# EasyEDA schematic SCH_CM_Mesa_7i92TH_2024-10-26.json
TITLE: Sheet_1; REV: 1.0; Date: 2022-04-24; Sheet: 1/1; Drawn By: timoa; Company: Your Company
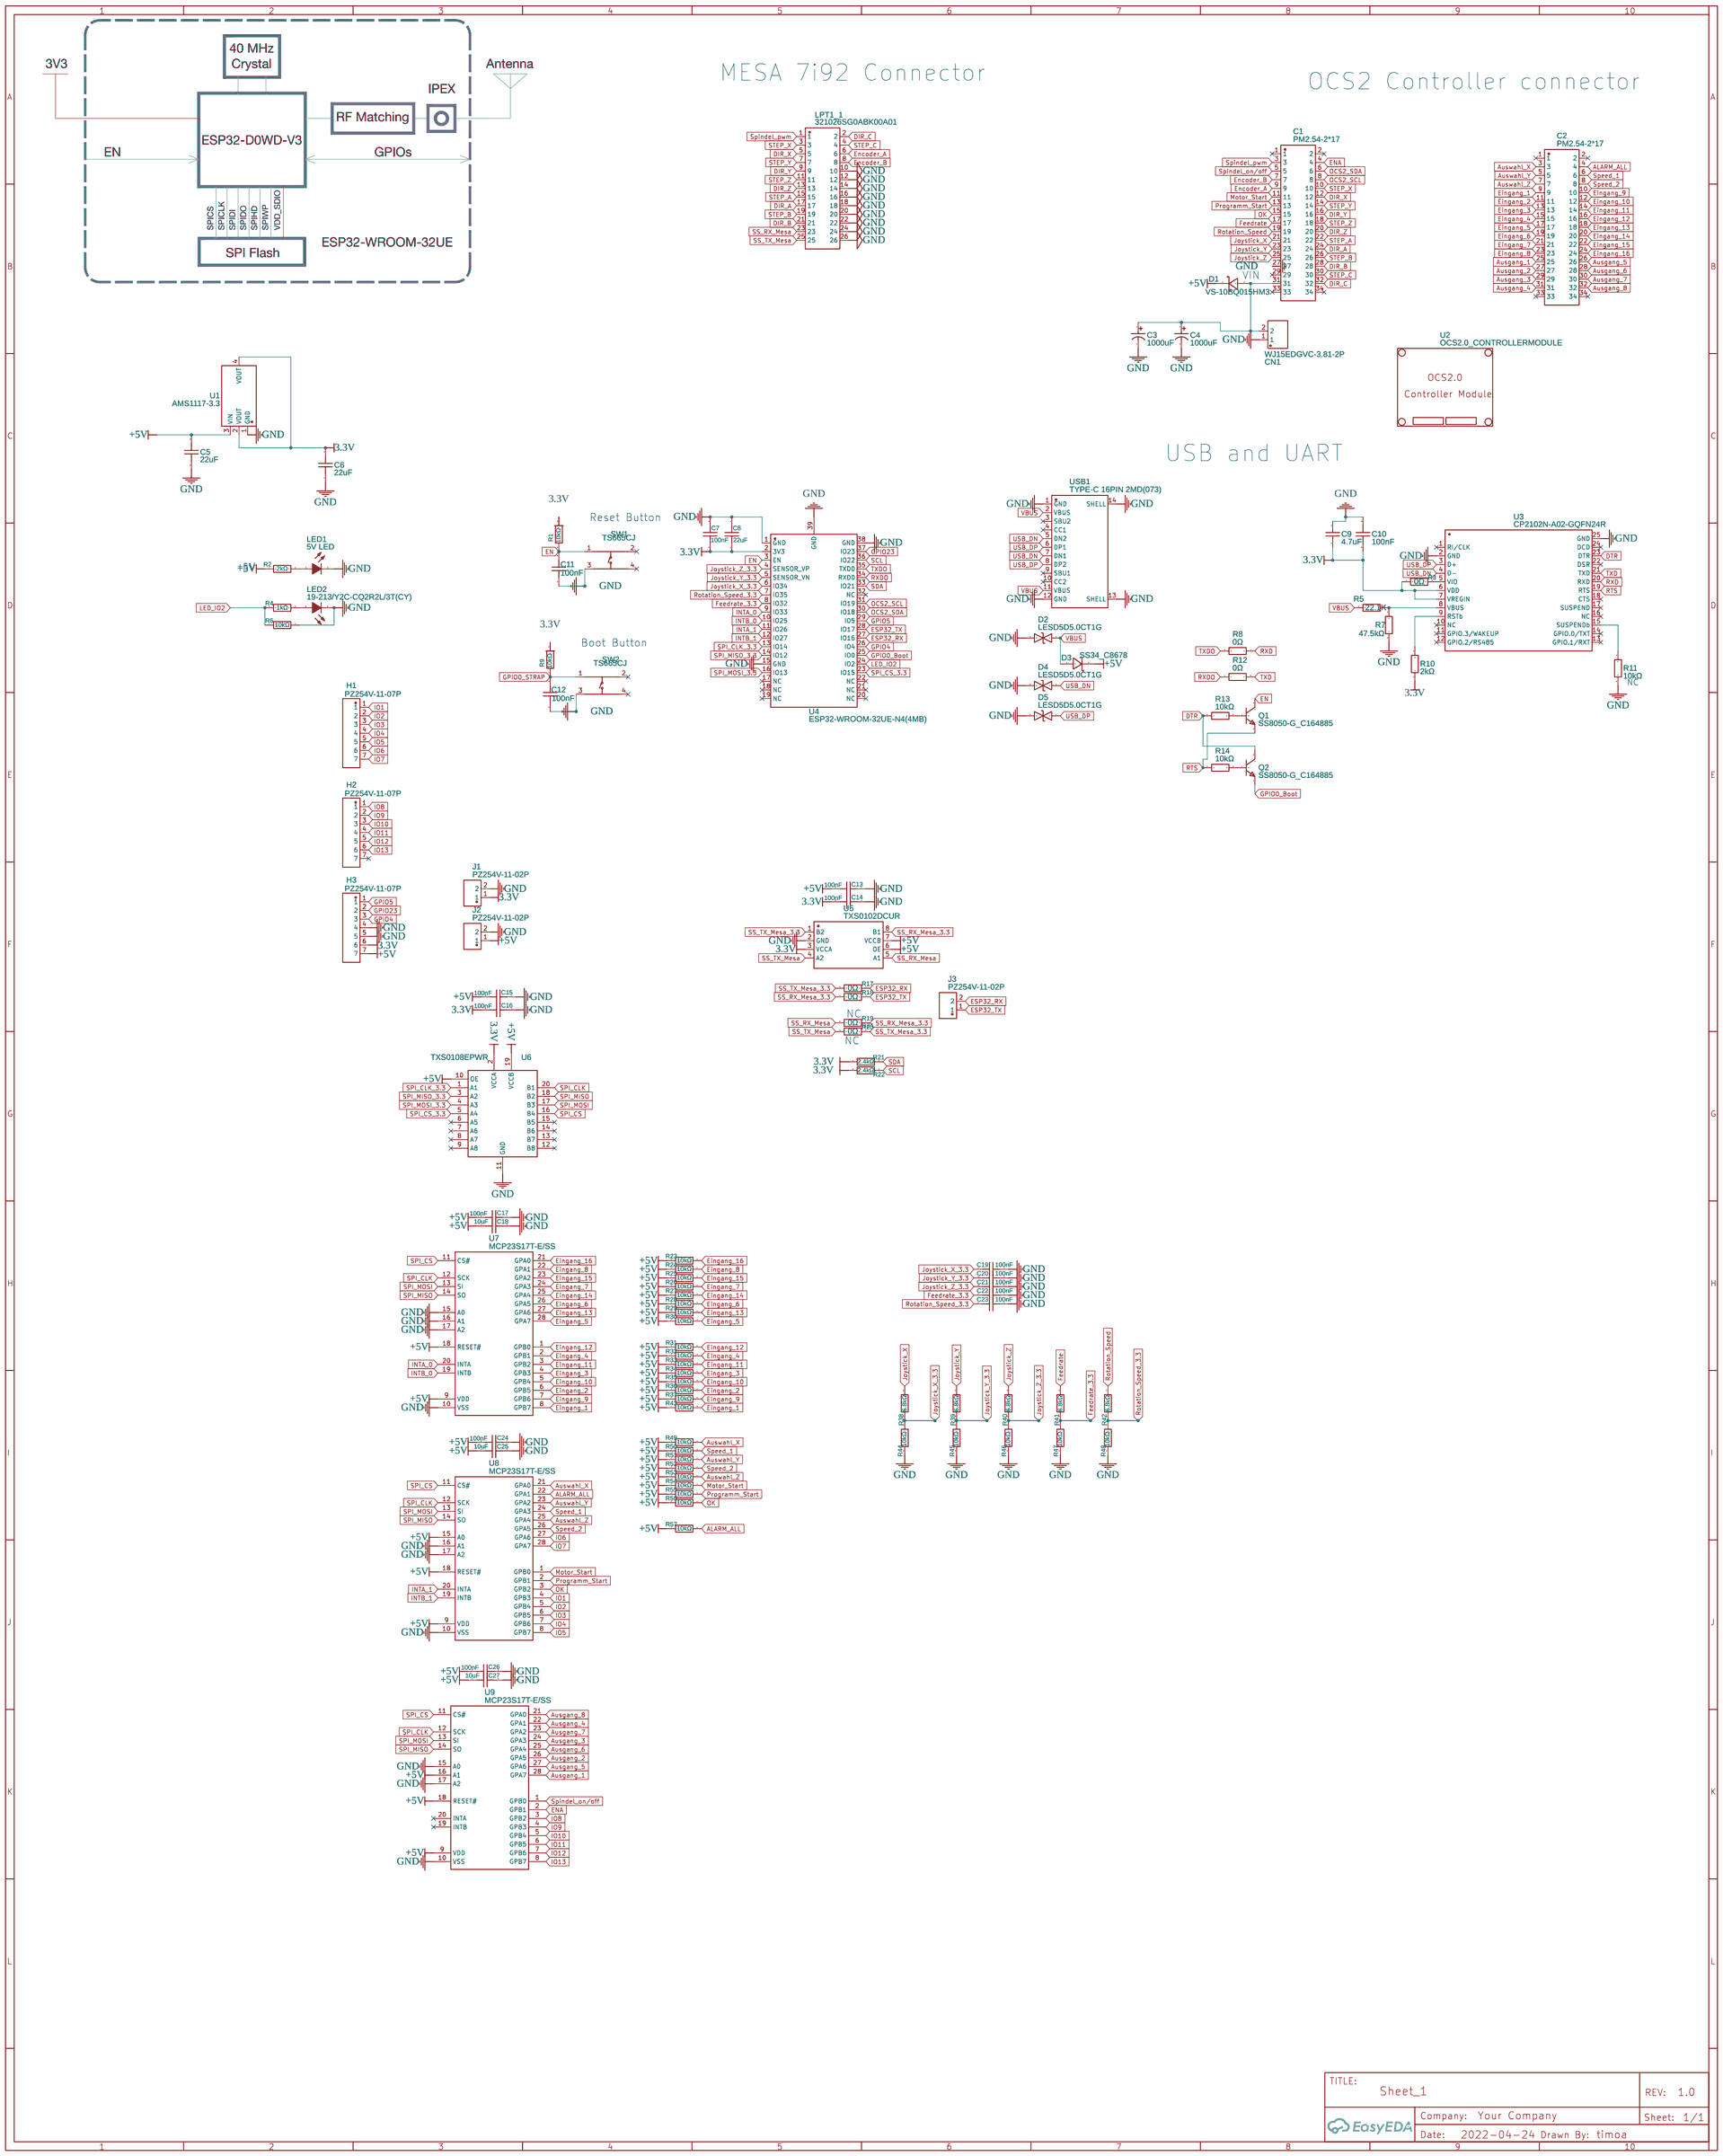
[diagram p0: schematic sheet]

## Parts
C1  PM2.54-2*17  [HDR-TH_34P-P2.54-V-F-R2-C17-S2.54]
C2  PM2.54-2*17  [HDR-TH_34P-P2.54-V-F-R2-C17-S2.54]
C3  1000uF  [CAP-SMD_BD10.0-L10.3-W10.3-FD]
C4  1000uF  [CAP-SMD_BD10.0-L10.3-W10.3-FD]
C5  22uF  [C1210]
C6  22uF  [C1210]
C7  100nF  [C0603]
C8  22uF  [C1210]
C9  4.7uF  [C0402]
C10  100nF  [C0603]
C11  100nF  [C0603]
C12  100nF  [C0603]
C13  100nF  [C0603]
C14  100nF  [C0603]
C15  100nF  [C0603]
C16  100nF  [C0603]
C17  100nF  [C0603]
C18  10uF  [C0603]
C19  100nF  [C0603]
C20  100nF  [C0603]
C21  100nF  [C0603]
C22  100nF  [C0603]
C23  100nF  [C0603]
C24  100nF  [C0603]
C25  10uF  [C0603]
C26  100nF  [C0603]
C27  10uF  [C0603]
CN1  WJ15EDGVC-3.81-2P  [CONN-TH_WJ15EDGVC-3.81-2P]
D1  VS-10BQ015HM3  [SMB_L4.6-W3.6-LS5.3-RD]
D2  LESD5D5.0CT1G  [SOD-523_L1.2-W0.8-LS1.6-BI]
D3  SS34_C8678  [DO-214AC_L4.3-W2.7-LS5.3-RD]
D4  LESD5D5.0CT1G  [SOD-523_L1.2-W0.8-LS1.6-BI]
D5  LESD5D5.0CT1G  [SOD-523_L1.2-W0.8-LS1.6-BI]
H1  PZ254V-11-07P  [HDR-TH_7P-P2.54-V-M]
H2  PZ254V-11-07P  [HDR-TH_7P-P2.54-V-M]
H3  PZ254V-11-07P  [HDR-TH_7P-P2.54-V-M]
J1  PZ254V-11-02P  [HDR-TH_2P-P2.54-V-M]
J2  PZ254V-11-02P  [HDR-TH_2P-P2.54-V-M]
J3  PZ254V-11-02P  [HDR-TH_2P-P2.54-V-M]
LED1  5V LED  [LED0603-R-RD]
LED2  19-213/Y2C-CQ2R2L/3T(CY)  [LED0603-RD-YELLOW]
LPT1_1  321026SG0ABK00A01  [IDC-TH_321026SG0ABK00A01]
Q1  SS8050-G_C164885  [SOT-23-3_L2.9-W1.3-P1.90-LS2.4-BR]
Q2  SS8050-G_C164885  [SOT-23-3_L2.9-W1.3-P1.90-LS2.4-BR]
R1  10kΩ  [R0402]
R2  2kΩ  [R0402]
R3  0Ω  [R0402]
R4  1kΩ  [R0402]
R5  22.1K  [R0603]
R6  10kΩ  [R0402]
R7  47.5kΩ  [R0805]
R8  0Ω  [R0603]
R9  10kΩ  [R0402]
R10  2kΩ  [R0402]
R11  10kΩ  [R0402]
R12  0Ω  [R0603]
R13  10kΩ  [R0402]
R14  10kΩ  [R0402]
R17  0Ω  [R0402]
R18  0Ω  [R0402]
R19  0Ω  [R0402]
R20  0Ω  [R0402]
R21  2.4kΩ  [R0402]
R22  2.4kΩ  [R0402]
R23  10kΩ  [R0402]
R24  10kΩ  [R0402]
R25  10kΩ  [R0402]
R26  10kΩ  [R0402]
R27  10kΩ  [R0402]
R28  10kΩ  [R0402]
R29  10kΩ  [R0402]
R30  10kΩ  [R0402]
R31  10kΩ  [R0402]
R32  10kΩ  [R0402]
R33  10kΩ  [R0402]
R34  10kΩ  [R0402]
R35  10kΩ  [R0402]
R36  10kΩ  [R0402]
R37  10kΩ  [R0402]
R38  6.8kΩ  [R0805]
R39  6.8kΩ  [R0805]
R40  6.8kΩ  [R0805]
R41  6.8kΩ  [R0805]
R42  6.8kΩ  [R0805]
R43  10kΩ  [R0402]
R44  10kΩ  [R0805]
R45  10kΩ  [R0805]
R46  10kΩ  [R0805]
R47  10kΩ  [R0805]
R48  10kΩ  [R0805]
R49  10kΩ  [R0402]
R50  10kΩ  [R0402]
R51  10kΩ  [R0402]
R52  10kΩ  [R0402]
R53  10kΩ  [R0402]
R54  10kΩ  [R0402]
R55  10kΩ  [R0402]
R56  10kΩ  [R0402]
R57  10kΩ  [R0402]
SW1  TS665CJ  [SW-TH_4P-L6.0-W6.0-P4.50-LS6.5]
SW2  TS665CJ  [SW-TH_4P-L6.0-W6.0-P4.50-LS6.5]
U1  AMS1117-3.3  [SOT-223-3_L6.5-W3.4-P2.30-LS7.0-BR]
U2  OCS2.0_CONTROLLERMODULE  [OCS2.0_CONTROLLERMODULE]
U3  CP2102N-A02-GQFN24R  [QFN-24_L4.0-W4.0-P0.50-TL-EP2.6]
U4  ESP32-WROOM-32UE-N4(4MB)  [WIFI-SMD_ESP32-WROOM-32UE]
U5  TXS0102DCUR  [VSON8_L2.0-W2.3-P0.50-LS3.1-BL]
U6  TXS0108EPWR  [TSSOP-20_L6.5-W4.4-P0.65-LS6.4-BL]
U7  MCP23S17T-E/SS  [SSOP-28_L10.2-W5.3-P0.65-LS7.8-BL]
U8  MCP23S17T-E/SS  [SSOP-28_L10.2-W5.3-P0.65-LS7.8-BL]
U9  MCP23S17T-E/SS  [SSOP-28_L10.2-W5.3-P0.65-LS7.8-BL]
USB1  TYPE-C 16PIN 2MD(073)  [USB-C-SMD_TYPE-C-6PIN-2MD-073]

## Library data of the parts
C1 C2 = PM2.54-2*17: Supplier: LCSC; Supplier Part: C92264; Manufacturer: CONNFLY; link: https://atta.szlcsc.com/upload/public/pdf/source/20220801/BEA4E9C8FE73AA45B444FF3040B9BCEC.pdf; Contributor: lcsc
C3 C4 = UT1C102M1010VG: Supplier: LCSC; Manufacturer: CX(承兴); Manufacturer Part: RVT1C102M1010VG; Supplier Part: C82017; JLCPCB Part Class: Extended Part
C5 C6 C8 = CC1210ZKY5V6BB226: Contributor: lcsc; Supplier: LCSC; Supplier Part: C577288; Manufacturer: YAGEO(国巨); JLCPCB Part Class: Extended Part; link: https://lcsc.com/eda_search?q=C577288&%26type=1&ref=editor
C7 C11 C12 = CC0603KRX7R9BB104: Supplier: LCSC; Manufacturer: YAGEO(国巨); Supplier Part: C14663; JLCPCB Part Class: Basic Part; link: https://lcsc.com/eda_search?q=C14663&%26type=1&ref=editor
C9 = CL05A475MP5NRNC: Supplier: LCSC; Manufacturer: SAMSUNG(三星); Supplier Part: C23733; JLCPCB Part Class: Basic Part
C10 C13-C17 C19-C24 C26 = CC0603KRX7R9BB104: Supplier: LCSC; Manufacturer: YAGEO(国巨); Supplier Part: C14663; JLCPCB Part Class: Basic Part
C18 C25 C27 = CL10A106KP8NNNC: Supplier: LCSC; Manufacturer: SAMSUNG(三星); Supplier Part: C19702; JLCPCB Part Class: Basic Part
CN1 = WJ15EDGVC-3.81-2P: Supplier: LCSC; Manufacturer: KANGNEX(康奈克斯电气); Supplier Part: C8396; JLCPCB Part Class: Extended Part; link: https://lcsc.com/eda_search?q=C8396&%26type=1&ref=editor
D1 = VS-10BQ015HM3/5BT: Supplier: LCSC; Supplier Part: C920329; Manufacturer: Vishay Intertech; Contributor: LCSC; JLCPCB Part Class: Extended Part
D2 D4 D5 = LESD5D5.0CT1G: Supplier: LCSC; Supplier Part: C383211; Manufacturer: Leshan Radio; Contributor: LCSC; JLCPCB Part Class: Extended Part
D3 = SS34_C8678: Supplier: LCSC; Manufacturer Part: SS34; Manufacturer: MDD; Supplier Part: C8678; JLCPCB Part Class: Basic Part
H1-H3 = PZ254V-11-07P: Contributor: LCSC; Supplier: LCSC; Supplier Part: C492406; Manufacturer: XFCN(兴飞); JLCPCB Part Class: Extended Part
J1-J3 = PZ254V-11-02P: Supplier: LCSC; Supplier Part: C492401; Manufacturer: XFCN; Contributor: LCSC; JLCPCB Part Class: Extended Part
LED1 = 19-213/Y2C-CQ2R2L/3T(CY): Supplier: LCSC; Manufacturer: EVERLIGHT; Supplier Part: C72038; JLCPCB Part Class: Basic Part
LED2 = 19-213/Y2C-CQ2R2L/3T(CY): Supplier: LCSC; Manufacturer: EVERLIGHT(亿光); Supplier Part: C72038; JLCPCB Part Class: Basic Part
LPT1_1 = 321026SG0ABK00A01: Supplier: LCSC; Supplier Part: C601941; Manufacturer: JILN; Contributor: LCSC; JLCPCB Part Class: Extended Part
Q1 Q2 = SS8050-G_C164885: Supplier: LCSC; Supplier Part: C164885; Manufacturer: CJ(江苏长电/长晶); Manufacturer Part: SS8050-G; Contributor: LCSC; JLCPCB Part Class: Extended Part
R1 R6 R9 R23-R37 R43 R49-R57 = 0402WGF1002TCE: Supplier: LCSC; Manufacturer: UniOhm; Supplier Part: C25744; Resistance (Ohms): 10K; JLCPCB Part Class: Basic Part
R2 = 0402WGF2001TCE: Supplier: LCSC; Manufacturer: UNI-ROYAL(厚声); Supplier Part: C4109; JLCPCB Part Class: Basic Part; link: https://lcsc.com/eda_search?q=C4109&%26type=1&ref=editor
R3 R17-R20 = 0402WGF0000TCE: Supplier: LCSC; Manufacturer: UNI-ROYAL(厚声); Supplier Part: C17168; JLCPCB Part Class: Basic Part; link: https://lcsc.com/eda_search?q=C17168&%26type=1&ref=editor
R4 = 0402WGF1001TCE: Supplier: LCSC; Manufacturer: UNI-ROYAL(厚声); Supplier Part: C11702; JLCPCB Part Class: Basic Part; link: https://lcsc.com/eda_search?q=C11702&%26type=1&ref=editor
R5 = RC0603FR-0722K1L: Supplier: LCSC; Manufacturer: YAGEO(国巨); Supplier Part: C137768; JLCPCB Part Class: Extended Part; Resistance: 22.1kΩ
R7 = RTT054752FTP: Supplier: LCSC; Manufacturer: RALEC; Resistance (Ohms): 47.5K; Contributor: LCSC; Supplier Part: C104355; JLCPCB Part Class: Extended Part
R8 R12 = 0603WAF0000T5E: Supplier: LCSC; Manufacturer: UNI-ROYAL(厚声); Supplier Part: C21189; Resistance (Ohms): 0; JLCPCB Part Class: Basic Part
R10 = 0402WGF2001TCE: Supplier: LCSC; Manufacturer: UNI-ROYAL(厚声); Supplier Part: C4109; Resistance (Ohms): 2K; JLCPCB Part Class: Basic Part
R11 R13 R14 = 0402WGF1002TCE: Supplier: LCSC; Manufacturer: UNI-ROYAL(厚声); Supplier Part: C25744; Resistance (Ohms): 10K; JLCPCB Part Class: Basic Part
R21 R22 = 0402WGF2401TCE: Supplier: LCSC; Manufacturer: UniOhm; Supplier Part: C25882; Resistance (Ohms): 2.4K; JLCPCB Part Class: Basic Part
R38-R42 = 0805W8F6801T5E: Supplier: LCSC; Manufacturer: UNI-ROYAL(厚声); Supplier Part: C17772; JLCPCB Part Class: Basic Part
R44-R48 = 0805W8F1002T5E: Supplier: LCSC; Manufacturer: UNI-ROYAL(厚声); Supplier Part: C17414; JLCPCB Part Class: Basic Part
SW1 SW2 = TS665CJ: Supplier: LCSC; Supplier Part: C393938; Manufacturer: SHOU HAN; Contributor: LCSC; JLCPCB Part Class: Extended Part
U1 = AMS1117-3.3: sourceId: dwIGgezVh; Supplier: LCSC; Manufacturer: AMS; Supplier Part: C6186; JLCPCB Part Class: Basic Part; link: https://lcsc.com/eda_search?q=C6186&%26type=1&ref=editor
U2 = OCS2.0_CONTROLLERMODULE: Manufacturer: timo; Supplier: timo; Contributor: timoa
U3 = CP2102N-A02-GQFN24R: Contributor: LCSC; Supplier: LCSC; Supplier Part: C969151; Manufacturer: SILICON LABS(芯科); JLCPCB Part Class: Extended Part; link: https://lcsc.com/eda_search?q=C969151&%26type=1&ref=editor
U4 = ESP32-WROOM-32UE(4MB): Contributor: LCSC; Supplier: LCSC; Supplier Part: C701344; Manufacturer: ESPRESSIF(乐鑫); Manufacturer Part: ESP32-WROOM-32UE-N4; JLCPCB Part Class: Extended Part; link: https://lcsc.com/eda_search?q=C701344&%26type=1&ref=editor
U5 = TXS0102DCUR: Supplier: LCSC; Manufacturer: TI(德州仪器); Supplier Part: C53434; JLCPCB Part Class: Extended Part; link: https://lcsc.com/eda_search?q=C53434&%26type=1&ref=editor
U6 = TXS0108EPWR: Supplier: LCSC; Manufacturer: TI(德州仪器); Supplier Part: C17206; JLCPCB Part Class: Extended Part; link: https://lcsc.com/eda_search?q=C17206&%26type=1&ref=editor
U7-U9 = MCP23S17T-E/SS: Contributor: LCSC; Supplier: LCSC; Manufacturer: MICROCHIP(美国微芯); Supplier Part: C128577; JLCPCB Part Class: Extended Part
USB1 = TYPE-C 16PIN 2MD(073): Contributor: LCSC; Supplier: LCSC; Supplier Part: C2765186; Manufacturer: SHOU HAN(首韩); JLCPCB Part Class: Extended Part; link: https://lcsc.com/eda_search?q=C2765186&%26type=1&ref=editor

## Nets
3.3V: C6.2 C7.1 C8.1 C9.1 C10.1 C14.2 C16.2 H3.6 J1.1 R1.2 R3.2 R9.2 R10.1 R21.2 R22.2 U1.2(VOUT) U1.4(VOUT) U3.6(VDD) U3.7(VREGIN) U4.2(3V3) U5.3(VCCA) U6.2(VCCA)
+5V: C5.2 C13.2 C15.2 C17.2 C18.1 C24.2 C25.1 C26.2 C27.1 D1.1(C) D3.1(K) H3.7 J2.1 R2.1 R23.1 R24.1 R25.1 R26.1 R27.1 R28.1 R29.1 R30.1 R31.1 R32.1 R33.1 R34.1 R35.1 R36.1 R37.1 R43.1 R49.1 R50.1 R51.1 R52.1 R53.1 R54.1 R55.1 R56.1 R57.1 U1.3(VIN) U5.6(OE) U5.7(VCCB) U6.10(OE) U6.19(VCCB) U7.9(VDD) U7.18(RESET#) U8.9(VDD) U8.15(A0) U8.18(RESET#) U9.9(VDD) U9.16(A1) U9.18(RESET#)
GND: C1.27 C3.2 C4.2 C5.1 C6.1 C7.2 C8.2 C9.2 C10.2 C11.1 C12.1 C13.1 C14.1 C15.1 C16.1 C17.1 C18.2 C19.1 C20.1 C21.1 C22.1 C23.1 C24.1 C25.2 C26.1 C27.2 CN1.1 D2.2 D4.2 D5.2 H3.4 H3.5 J1.2 J2.2 LED1.2(C) LED2.1(C) LPT1_1.10 LPT1_1.12 LPT1_1.14 LPT1_1.16 LPT1_1.18 LPT1_1.20 LPT1_1.22 LPT1_1.24 LPT1_1.26 R6.2 R7.1 R11.2 R44.1 R45.1 R46.1 R47.1 R48.1 SW1.3(C) SW2.3(C) U1.1(GND) U3.2(GND) U3.25(GND) U4.1(GND) U4.15(GND) U4.38(GND) U4.39(GND) U5.2(GND) U6.11(GND) U7.10(VSS) U7.15(A0) U7.16(A1) U7.17(A2) U8.10(VSS) U8.16(A1) U8.17(A2) U9.10(VSS) U9.15(A0) U9.17(A2) USB1.1(GND) USB1.12(GND) USB1.13(SHELL) USB1.14(SHELL)
VBUS: D2.1 D3.2(A) R5.1 USB1.2(VBUS) USB1.11(VBUS)
ALARM_ALL: C2.4 R57.2 U8.22(GPA1)
Ausgang_1: C2.25 U9.28(GPA7)
Ausgang_2: C2.27 U9.26(GPA5)
Ausgang_3: C2.29 U9.24(GPA3)
Ausgang_4: C2.31 U9.22(GPA1)
Ausgang_5: C2.26 U9.27(GPA6)
Ausgang_6: C2.28 U9.25(GPA4)
Ausgang_7: C2.30 U9.23(GPA2)
Ausgang_8: C2.32 U9.21(GPA0)
Auswahl_X: C2.3 R49.2 U8.21(GPA0)
Auswahl_Y: C2.5 R51.2 U8.23(GPA2)
Auswahl_Z: C2.7 R53.2 U8.25(GPA4)
DIR_A: C1.24 LPT1_1.17
DIR_B: C1.28 LPT1_1.21
DIR_C: C1.32 LPT1_1.2
DIR_X: C1.12 LPT1_1.5
DIR_Y: C1.16 LPT1_1.9
DIR_Z: C1.20 LPT1_1.13
DTR: Q2.3(C) R13.1 U3.23(DTR)
Eingang_1: C2.9 R43.2 U7.8(GPB7)
Eingang_2: C2.11 R36.2 U7.6(GPB5)
Eingang_3: C2.13 R34.2 U7.4(GPB3)
Eingang_4: C2.15 R32.2 U7.2(GPB1)
Eingang_5: C2.17 R30.2 U7.28(GPA7)
Eingang_6: C2.19 R28.2 U7.26(GPA5)
Eingang_7: C2.21 R26.2 U7.24(GPA3)
Eingang_8: C2.23 R24.2 U7.22(GPA1)
Eingang_9: C2.10 R37.2 U7.7(GPB6)
Eingang_10: C2.12 R35.2 U7.5(GPB4)
Eingang_11: C2.14 R33.2 U7.3(GPB2)
Eingang_12: C2.16 R31.2 U7.1(GPB0)
Eingang_13: C2.18 R29.2 U7.27(GPA6)
Eingang_14: C2.20 R27.2 U7.25(GPA4)
Eingang_15: C2.22 R25.2 U7.23(GPA2)
Eingang_16: C2.24 R23.2 U7.21(GPA0)
EN: C11.2 Q1.3(C) R1.1 SW1.1(A) U4.3(EN)
ENA: C1.4 U9.2(GPB1)
Encoder_A: C1.9 LPT1_1.6
Encoder_B: C1.7 LPT1_1.8
ESP32_RX: J3.2 R17.1 U4.27(IO16)
ESP32_TX: J3.1 R18.1 U4.28(IO17)
Feedrate: C1.17 R41.2
Feedrate_3.3: C22.2 R41.1 R47.2 U4.8(IO32)
GPIO0_Boot: Q2.2(E) U4.25(IO0)
GPIO0_STRAP: C12.2 R9.1 SW2.1(A)
GPIO4: H3.3 U4.26(IO4)
GPIO5: H3.1 U4.29(IO5)
GPIO23: H3.2 U4.37(IO23)
INTA_0: U4.9(IO33) U7.20(INTA)
INTA_1: U4.11(IO26) U8.20(INTA)
INTB_0: U4.10(IO25) U7.19(INTB)
INTB_1: U4.12(IO27) U8.19(INTB)
IO1: H1.1 U8.4(GPB3)
IO2: H1.2 U8.5(GPB4)
IO3: H1.3 U8.6(GPB5)
IO4: H1.4 U8.7(GPB6)
IO5: H1.5 U8.8(GPB7)
IO6: H1.6 U8.27(GPA6)
IO7: H1.7 U8.28(GPA7)
IO8: H2.1 U9.3(GPB2)
IO9: H2.2 U9.4(GPB3)
IO10: H2.3 U9.5(GPB4)
IO11: H2.4 U9.6(GPB5)
IO12: H2.5 U9.7(GPB6)
IO13: H2.6 U9.8(GPB7)
Joystick_X: C1.21 R38.2
Joystick_X_3.3: C19.2 R38.1 R44.2 U4.6(IO34)
Joystick_Y: C1.23 R39.2
Joystick_Y_3.3: C20.2 R39.1 R45.2 U4.5(SENSOR_VN)
Joystick_Z: C1.25 R40.2
Joystick_Z_3.3: C21.2 R40.1 R46.2 U4.4(SENSOR_VP)
LED_IO2: R4.1 R6.1 U4.24(IO2)
Motor_Start: C1.11 R54.2 U8.1(GPB0)
OCS2_SCL: C1.8 U4.31(IO19)
OCS2_SDA: C1.6 U4.30(IO18)
OK: C1.15 R56.2 U8.3(GPB2)
Programm_Start: C1.13 R55.2 U8.2(GPB1)
Rotation_Speed: C1.19 R42.2
Rotation_Speed_3.3: C23.2 R42.1 R48.2 U4.7(IO35)
RTS: Q1.2(E) R14.1 U3.19(RTS)
RXD: R8.2 U3.20(RXD)
RXDO: R12.1 U4.34(RXD0)
SCL: R22.1 U4.36(IO22)
SDA: R21.1 U4.33(IO21)
Speed_1: C2.6 R50.2 U8.24(GPA3)
Speed_2: C2.8 R52.2 U8.26(GPA5)
SPI_CLK: U6.20(B1) U7.12(SCK) U8.12(SCK) U9.12(SCK)
SPI_CLK_3.3: U4.13(IO14) U6.1(A1)
SPI_CS: U6.16(B4) U7.11(CS#) U8.11(CS#) U9.11(CS#)
SPI_CS_3.3: U4.23(IO15) U6.5(A4)
SPI_MISO: U6.18(B2) U7.14(SO) U8.14(SO) U9.14(SO)
SPI_MISO_3.3: U4.14(IO12) U6.3(A2)
SPI_MOSI: U6.17(B3) U7.13(SI) U8.13(SI) U9.13(SI)
SPI_MOSI_3.3: U4.16(IO13) U6.4(A3)
Spindel_on/off: C1.5 U9.1(GPB0)
Spindel_pwm: C1.3 LPT1_1.1
SS_RX_Mesa: LPT1_1.23 R19.2 U5.5(A1)
SS_RX_Mesa_3.3: R18.2 R19.1 U5.8(B1)
SS_TX_Mesa: LPT1_1.25 R20.2 U5.4(A2)
SS_TX_Mesa_3.3: R17.2 R20.1 U5.1(B2)
STEP_A: C1.22 LPT1_1.15
STEP_B: C1.26 LPT1_1.19
STEP_C: C1.30 LPT1_1.4
STEP_X: C1.10 LPT1_1.3
STEP_Y: C1.14 LPT1_1.7
STEP_Z: C1.18 LPT1_1.11
TXD: R12.2 U3.21(TXD)
TXDO: R8.1 U4.35(TXD0)
USB_DN: D4.1 U3.4(D-) USB1.5(DN2) USB1.7(DN1)
USB_DP: D5.1 U3.3(D+) USB1.6(DP1) USB1.8(DP2)
Net-(C1-31): C1.31 C3.1 C4.1 CN1.2 D1.2(A)
Net-(LED1-1): LED1.1(A) R2.2
Net-(LED2-2): LED2.2(A) R4.2
Net-(Q1-1): Q1.1(B) R13.2
Net-(Q2-1): Q2.1(B) R14.2
Net-(R3-1): R3.1 U3.5(VIO)
Net-(R5-2): R5.2 R7.2 U3.8(VBUS)
Net-(R10-2): R10.2 U3.9(RSTb)
Net-(R11-1): R11.1 U3.15(SUSPENDb)

Not connected (* = marked no-connect by the designer): C1 1* 2* 29* 33* 34*; C2 1* 2* 33* 34*; H2 7*; SW1 2(B)* 4(D)*; SW2 2(B)* 4(D)*; U3 1(RI/CLK)* 10(NC)* 11(GPIO.3/WAKEUP)* 12(GPIO.2/RS485)* 13(GPIO.1/RXT)* 14(GPIO.0/TXT)* 16(NC)* 17(SUSPEND)* 18(CTS)* 22(DSR)* 24(DCD)*; U4 17(NC)* 18(NC)* 19(NC)* 20(NC)* 21(NC)* 22(NC)* 32(NC)*; U6 6(A5)* 7(A6)* 8(A7)* 9(A8)* 12(B8)* 13(B7)* 14(B6)* 15(B5)*; U9 19(INTB)* 20(INTA)*; USB1 3(SBU2)* 4(CC1)* 9(SBU1)* 10(CC2)*

## Notes on the sheet
- MESA 7i92 Connector
- OCS2 Controller connector
- VIN
- USB and UART
- Reset Button
- +5V
- Boot Button
- NC
- NC
- R24
- NC
